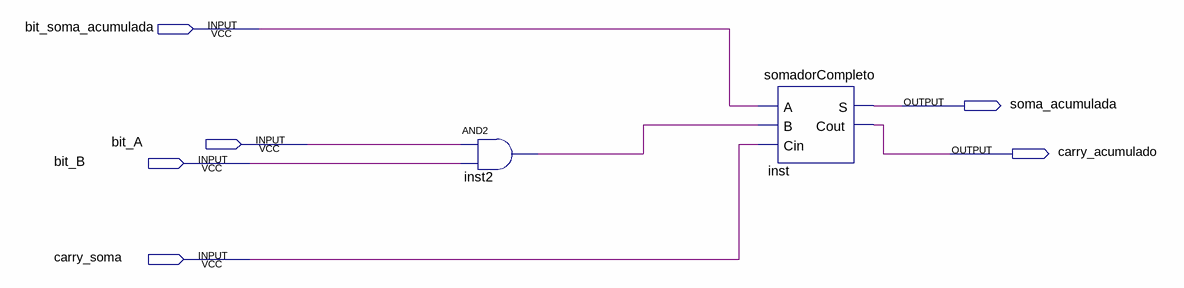
[diagram p0: schematic sheet]
// Quartus schematic multiplicadorSomador.bdf as structural Verilog: 2 symbols, 6 pins
module multiplicadorSomador (
  input  bit_soma_acumulada,
  input  bit_A,
  input  bit_B,
  input  carry_soma,
  output soma_acumulada,
  output carry_acumulado
);

  wire inst2_out;

  and inst2 (inst2_out, bit_A, bit_B);
  somadorCompleto inst (
    .A(bit_soma_acumulada), .B(inst2_out), .Cin(carry_soma), .S(soma_acumulada), .Cout(carry_acumulado));
endmodule
